# Altium schematic sheet FCC_MCU.SchDoc
size A4; SheetNumber: 5; SheetTotal: 8
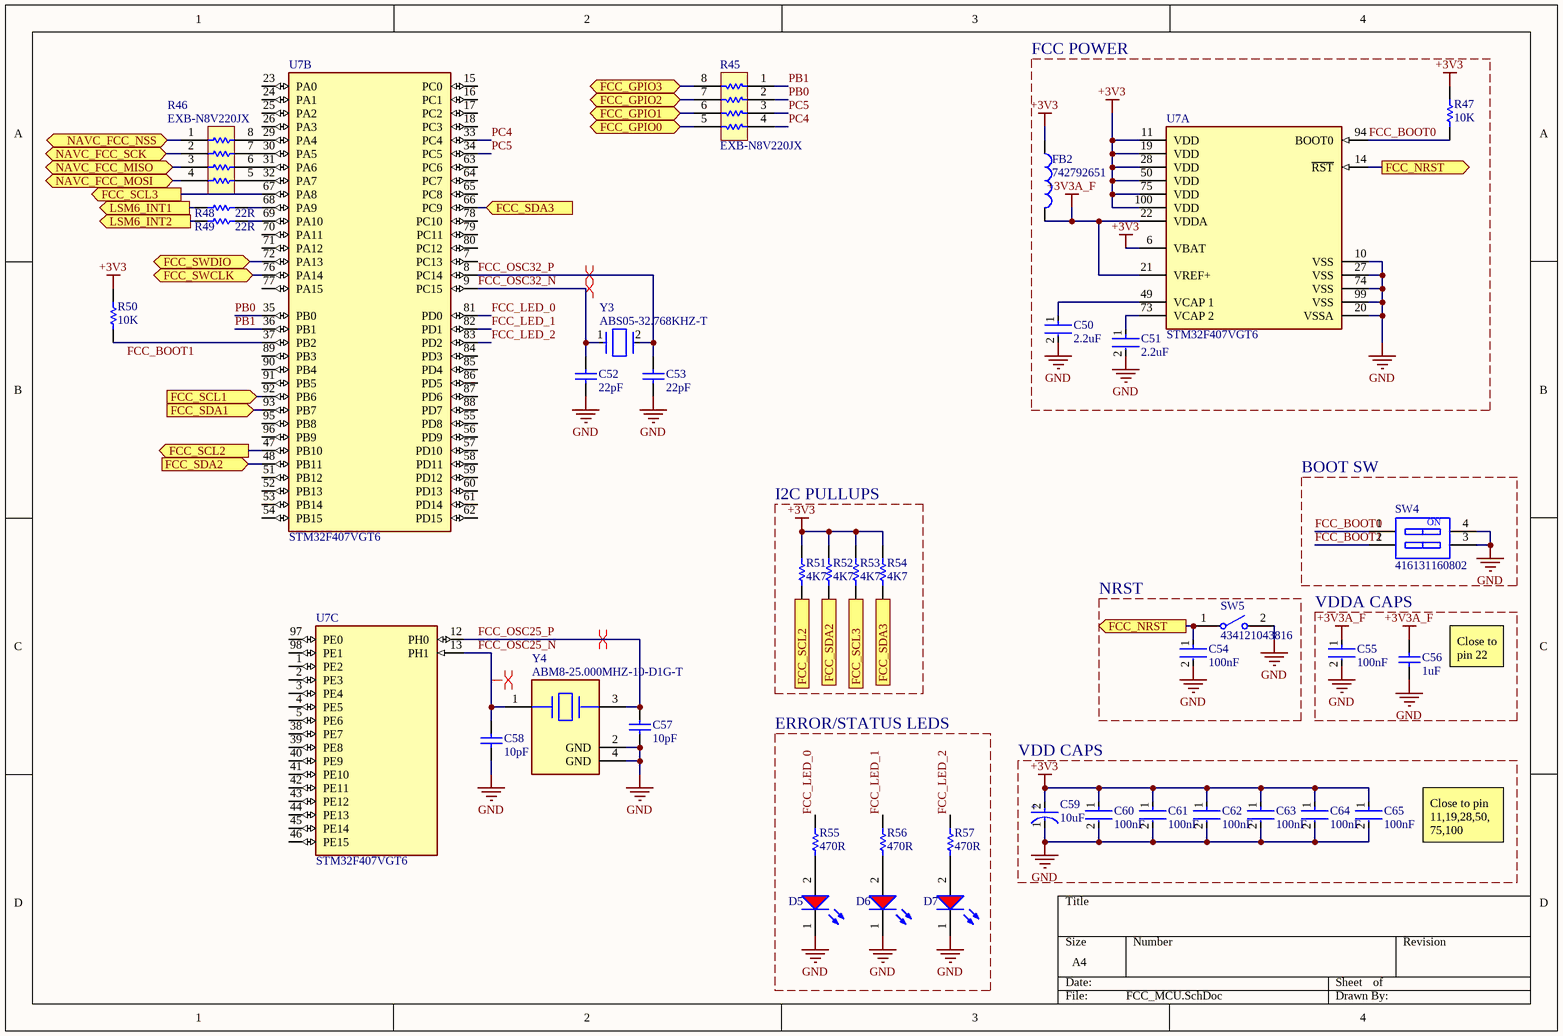
[diagram p0: FCC_MCU.SchDoc]

## Parts
C50  2.2uF  [FP-CGA3E-0_3-0_1-IPC_A]
C51  2.2uF  [FP-CGA3E-0_3-0_1-IPC_A]
C52  22pF  [CAPC1608X90X35ML10T15]
C53  22pF  [CAPC1608X90X35ML10T15]
C54  100nF  [FP-CGA3E-0_3-0_1-IPC_A]
C55  100nF  [FP-CGA3E-0_3-0_1-IPC_A]
C56  1uF  [CAPC1608X87X35LL15T15]
C57  10pF  [CAPC1608X90X35LL10T15]
C58  10pF  [CAPC1608X90X35LL10T15]
C59  10uF  [FP-T491A106K006AT-MFG]
C60  100nF  [FP-CGA3E-0_3-0_1-IPC_A]
C61  100nF  [FP-CGA3E-0_3-0_1-IPC_A]
C62  100nF  [FP-CGA3E-0_3-0_1-IPC_A]
C63  100nF  [FP-CGA3E-0_3-0_1-IPC_A]
C64  100nF  [FP-CGA3E-0_3-0_1-IPC_A]
C65  100nF  [FP-CGA3E-0_3-0_1-IPC_A]
D5  150120SS75000  [WL-SMCW_1206_150120xx75000]  (value not drawn)
D6  150120SS75000  [WL-SMCW_1206_150120xx75000]  (value not drawn)
D7  150120SS75000  [WL-SMCW_1206_150120xx75000]  (value not drawn)
FB2  742792651  [WE-CBF_0603_L1.6W0.8H0.8_HC]
R45  EXB-N8V220JX  [BOUR-CAT10_V]
R46  EXB-N8V220JX  [BOUR-CAT10_V]
R47  10K  [RESC1608X55X25ML10T15]
R48  22R  [RESC1608X55X25ML10T15]
R49  22R  [RESC1608X55X25ML10T15]
R50  10K  [RESC1608X55X25ML10T15]
R51  4K7  [RESC1608X55X25ML10T15]
R52  4K7  [RESC1608X55X25ML10T15]
R53  4K7  [RESC1608X55X25ML10T15]
R54  4K7  [RESC1608X55X25ML10T15]
R55  470R  [RESC1609X50X30NL8T20]
R56  470R  [RESC1609X50X30NL8T20]
R57  470R  [RESC1609X50X30NL8T20]
SW4  416131160802  [416131160802]
SW5  434121043816  [434121043816]
U7  STM32F407VGT6  [FP-LQFP100-1L-MFG]  (parts A,B,C of 3)
Y3  ABS05-32.768KHZ-T  [FP-ABS05-MFG]
Y4  ABM8-25.000MHZ-10-D1G-T  [FP-ABM8-MFG]

## Blocks framed on the sheet
FCC POWER: C50 C51 FB2 R47 U7
I2C PULLUPS: R51-R54
BOOT SW: SW4
NRST: C54 SW5
VDDA CAPS: C55 C56
ERROR/STATUS LEDS: D5-D7 R55-R57
VDD CAPS: C59-C65

## Ports
FCC_GPIO0 (bidir, see FCC_Connectors[1B]), FCC_GPIO1 (bidir, see FCC_Connectors[1B]), FCC_GPIO2 (bidir, see FCC_Connectors[1B]), FCC_GPIO3 (bidir, see FCC_Connectors[1B]), FCC_NRST (out, see FCC_Connectors[1A], FCC_MCU[3C]), FCC_NRST (out, see FCC_Connectors[1A], FCC_MCU[4A]), FCC_SCL1 (in, see FCC_Peripherals[1A]), FCC_SCL2 (out, see FCC_MCU[1B], FCC_Peripherals[2C]), FCC_SCL2 (out, see FCC_MCU[3C], FCC_Peripherals[2C]), FCC_SCL3 (out, see FCC_MCU[1A], FCC_Peripherals[2A]), FCC_SCL3 (out, see FCC_MCU[3C], FCC_Peripherals[2A]), FCC_SDA1 (in, see FCC_Peripherals[1B]), FCC_SDA2 (in, see FCC_MCU[3C], FCC_Peripherals[2C]), FCC_SDA2 (out, see FCC_MCU[1B], FCC_Peripherals[2C]), FCC_SDA3 (in, see FCC_MCU[3C], FCC_Peripherals[2A]), FCC_SDA3 (out, see FCC_MCU[2A], FCC_Peripherals[2A]), FCC_SWCLK (bidir, see FCC_Connectors[1A]), FCC_SWDIO (bidir, see FCC_Connectors[1A]), LSM6_INT1 (out, see FCC_Peripherals[2A]), LSM6_INT2 (out, see FCC_Peripherals[2A]), NAVC_FCC_MISO (bidir, see NAVC_MCU[1B]), NAVC_FCC_MOSI (bidir, see NAVC_MCU[1B]), NAVC_FCC_NSS (bidir, see NAVC_MCU[1B]), NAVC_FCC_SCK (bidir, see NAVC_MCU[1B])

## Nets
+3V3: C59.2(A) C60.1 C61.1 C62.1 C63.1 C64.1 C65.1 FB2.1 R47.1 R50.1 R51.2 R52.2 R53.2 R54.2 U7.6(VBAT) U7.11(VDD) U7.19(VDD) U7.28(VDD) U7.50(VDD) U7.75(VDD) U7.100(VDD)
+3V3A_F: C55.1 C56.2 FB2.2 U7.21(VREF+) U7.22(VDDA)
GND: C50.2 C51.2 C52.1 C53.1 C54.2 C55.2 C56.1 C57.1 C58.1 C59.1(C) C60.2 C61.2 C62.2 C63.2 C64.2 C65.2 D5.1(K) D6.1(K) D7.1(K) SW4.3 SW4.4 SW5.2 U7.10(VSS) U7.20(VSSA) U7.27(VSS) U7.74(VSS) U7.99(VSS) Y4.2(GND) Y4.4(GND)
FCC_BOOT0: R47.2 SW4.1 U7.94(BOOT0)
FCC_BOOT1: R50.2 SW4.2 U7.37(PB2)
FCC_GPIO0: R45.5 ; port FCC_GPIO0
FCC_GPIO1: R45.6 ; port FCC_GPIO1
FCC_GPIO2: R45.7 ; port FCC_GPIO2
FCC_GPIO3: R45.8 ; port FCC_GPIO3
FCC_LED_0: R55.1 U7.81(PD0)
FCC_LED_1: R56.1 U7.82(PD1)
FCC_LED_2: R57.1 U7.83(PD2)
FCC_NRST: C54.1 SW5.1 U7.14(~{RST}) ; port FCC_NRST
FCC_OSC25_N: C58.2 U7.13(PH1) Y4.1
FCC_OSC25_P: C57.2 U7.12(PH0) Y4.3
FCC_OSC32_N: C52.2 U7.9(PC15) Y3.1
FCC_OSC32_P: C53.2 U7.8(PC14) Y3.2
FCC_SCL1: U7.92(PB6) ; port FCC_SCL1
FCC_SCL2: R51.1 U7.47(PB10) ; port FCC_SCL2
FCC_SCL3: R53.1 U7.67(PA8) ; port FCC_SCL3
FCC_SDA1: U7.93(PB7) ; port FCC_SDA1
FCC_SDA2: R52.1 U7.48(PB11) ; port FCC_SDA2
FCC_SDA3: R54.1 U7.66(PC9) ; port FCC_SDA3
FCC_SWCLK: U7.76(PA14) ; port FCC_SWCLK
FCC_SWDIO: U7.72(PA13) ; port FCC_SWDIO
LSM6_INT1: R48.1 ; port LSM6_INT1
LSM6_INT2: R49.1 ; port LSM6_INT2
NAVC_FCC_MISO: R46.3 ; port NAVC_FCC_MISO
NAVC_FCC_MOSI: R46.4 ; port NAVC_FCC_MOSI
NAVC_FCC_NSS: R46.1 ; port NAVC_FCC_NSS
NAVC_FCC_SCK: R46.2 ; port NAVC_FCC_SCK
PB0: R45.2 U7.35(PB0)
PB1: R45.1 U7.36(PB1)
PC4: R45.4 U7.33(PC4)
PC5: R45.3 U7.34(PC5)
NetC50_1: C50.1 U7.49(VCAP_1)
NetC51_1: C51.1 U7.73(VCAP_2)
NetD5_2: D5.2(A) R55.2
NetD6_2: D6.2(A) R56.2
NetD7_2: D7.2(A) R57.2
NetR46_5: R46.5 U7.32(PA7)
NetR46_6: R46.6 U7.31(PA6)
NetR46_7: R46.7 U7.30(PA5)
NetR46_8: R46.8 U7.29(PA4)
NetR48_2: R48.2 U7.68(PA9)
NetR49_2: R49.2 U7.69(PA10)

Not connected (* = marked no-connect by the designer): U7 1(PE2) 2(PE3) 3(PE4) 4(PE5) 5(PE6) 7(PC13) 15(PC0) 16(PC1) 17(PC2) 18(PC3) 23(PA0) 24(PA1) 25(PA2) 26(PA3) 38(PE7) 39(PE8) 40(PE9) 41(PE10) 42(PE11) 43(PE12) 44(PE13) 45(PE14) 46(PE15) 51(PB12) 52(PB13) 53(PB14) 54(PB15) 55(PD8) 56(PD9) 57(PD10) 58(PD11) 59(PD12) 60(PD13) 61(PD14) 62(PD15) 63(PC6) 64(PC7) 65(PC8) 70(PA11) 71(PA12) 77(PA15) 78(PC10) 79(PC11) 80(PC12) 84(PD3) 85(PD4) 86(PD5) 87(PD6) 88(PD7) 89(PB3) 90(PB4) 91(PB5) 95(PB8) 96(PB9) 97(PE0) 98(PE1)

## Layout directives
differential pair: FCC_OSC25_N, FCC_OSC25_P, FCC_OSC32_N, FCC_OSC32_P

## Notes on the sheet
- (near C56) Close to pin 22
- Close to pin 11,19,28,50,
  75,100
- (in symbol CMP-1433-00002-2) ON
- (in symbol CMP-03017-000032-1) +

## Library data of the parts
C50 C51 C54 C55 C60-C65 = CMP-2000-07546-2: Cap Ceramic 100nF 50V X7R 10% Pad SMD 0603 +125°C Automotive T/R; Weight: 7.1E-05oz; Composition: Ceramic; Max Operating Temperature: 125°C; Termination: SMD/SMT; Dielectric: X7R; Length: 1.6mm; Package Quantity: 1; REACH SVHC: No SVHC; Lead Free: Lead Free; Case Code (Metric): 1608; Min Operating Temperature: -55°C; Packaging: Tape and Reel; Tolerance: 10%; Voltage Rating: 50V; Case Code (Imperial): 0603; Capacitance: 100nF; Case/Package: 0603; Voltage Rating (DC): 50V; Depth: 0.8mm; Radiation Hardening: No; Ratings: AEC-Q200; Mount: Surface Mount; Voltage: 50V; Thickness: 0.035inch; Width: 0.8mm; Height: 0.8mm
C52 C53 = CMP-2000-04945-1: Chip Capacitor, 22 pF, +/- 5%, 50 V, -55 to 125 degC, 0603 (1608 Metric), RoHS, Tape and Reel; Manufacturer: Murata; Rated Voltage: 50V; Dielectric: C0G; Capacitance: 22pF; Manufacturer URL: http://www.murata.com/; Datasheet Version: Jul-06; Package Reference: 603; Tolerance (%): ±5%; Case Size/Dimension: 0603; Package Description: 2-Pin Surface Mount Device, Body 1.6 x 0.8 mm; Datasheet URL: https://datasheet.ciiva.com/11786/0900766b807a1cab-11786398.pdf
C56 = CMP-2006-03713-1: Part Number: C0603C105K3RACTU; Manufacturer: Kemet
C57 C58 = CMP-2006-02592-1: Part Number: GRM1885C1H100JA01D; Manufacturer: Murata
C59 = CMP-03017-000032-1: CAP TANT 10UF 10% 6.3V 1206; Life (Hours): 2000Hour; Polarity: Polar; Dielectric Material: Tantalum; Leakage Current: 600nA; Dissipation Factor: 6%; ESR (Equivalent Series Resistance): 4R; Lead Free: Lead Free; Features: General Purpose; Length: 3.2mm; Mount: Surface Mount; Number of Pins: 2; RoHS Compliant: Yes; Case/Package: 1206; Width: 1.6mm; Capacitance: 10uF; REACH SVHC: No SVHC; Voltage Rating (DC): 6.3V; Max Operating Temperature: 125°C; Height - Seated (Max): 0.071inch; Termination: SMD/SMT; Radiation Hardening: No; Tolerance: 10%; Min Operating Temperature: -55°C; Lead Pitch: 1.2mm; Voltage: 6.3V; Depth: 1.6mm; Case Code (Imperial): 1206; Case Code (Metric): 3216; Packaging: Tape and Reel; Height: 1.6mm; Voltage Rating: 6.3V; Package Quantity: 1
D5-D7 = CMP-1426-00017-3: Led, Red, 630 Nm, 1.9 V, 30 Ma, 60 Mcd Rohs Compliant: Yes; Forward Current: 100mA; Max Reverse Voltage (DC): 5V; Lens Style: Clear, Rectangular; Viewing Angle: 140°; Luminous Intensity: 60mcd; Peak Wavelength: 645nm; Forward Voltage: 1.9V; Test Current: 20mA; Dominant Wavelength: 630nm; Case Code (Imperial): 1206; Length: 3.2mm; Mount: Surface Mount; Case Code (Metric): 3216; Case/Package: 1206; Min Operating Temperature: -40°C; Width: 1.6mm; Color: Red; Height: 680µm; REACH SVHC: Unknown; Max Operating Temperature: 85°C; Wavelength: 630nm; RoHS: Compliant; Packaging: Tape and Reel
FB2 = CMP-0220-00181-3: NexarPartId: 7864500; RMS Current (Irms): 1A; Number of Lines: 1; Test Frequency: 100MHz; Impedance: 600Ω; Inductance: 360mH; Resistance: 200mΩ; Tolerance: 25%; Case Code (Imperial): 0603; Lead Free: Lead Free; Current Rating: 1A; Height: 800µm; Min Operating Temperature: -55°C; Core Material: Ferrite; REACH SVHC: Unknown; Case/Package: 0603; Weight: 3.997283mg; Mount: Surface Mount; Termination: SMD/SMT; Case Code (Metric): 1608; DC Resistance (DCR): 200mΩ; Series Resistance: 200mΩ; Max Operating Temperature: 125°C; Width: 800µm; Length: 1.6mm; Max DC Current: 1A; RoHS: Compliant; Material: Ferrite; Max Current Rating: 1A; Depth: 800µm; Packaging: Cut Tape (CT)
R45 R46 = CMP-2000-06066-1: Chip Resistor Array, 22 Ohm, +/- 5%, -55 to 125 degC, 8-Pin SMD, RoHS, Tape and Reel; Manufacturer: Bourns; Resistance: 22Ohms; Temperature, Operating: -55to+125°C; Power, Rating: 0.125W; Number of Resistors: 4; Temperature, Coefficent: ±250; Brand/Series: CAT10Series; Circuit: IsolatedArray; Mounting Type: SurfaceMount; Tolerance: ±5%; Datasheet Version: 01/2015; Package Description: 8-Pin Surface Mount Device, Body 2 x 1 mm, Pitch 0.5 mm; Number of Terminals: 8; Dimensions: 0.44x0.039x0.022(2x1x0.55)LxWxHin.(mm); Package Reference: CAT10; Mounting Technology: SurfaceMount; Manufacturer URL: http://www.bourns.com/; Package Type: SMT; Datasheet URL: http://www.bourns.com/docs/Product-Datasheets/CAT10.pdf
R47-R54 = CMP-2100-03667-1: Chip Resistor, 0 Ohm, +/- 5%, 0.1 W, -55 to 155 degC, 0603 (1608 Metric), RoHS, Tape and Reel; Manufacturer: Yageo; Temperature Coefficient: 200ppm/degreesC; Voltage Rating: 50V; Power Rating: 100mW; Resistance: 0mOhm; Width: 0.8mm; Max Operating Temperature: 155degC; Tolerance: 5%; Package Reference: 0603; Height: 0.45mm; Depth: 0.8mm; Package Description: 2-Pin Surface Mount Device, Body 1.6 x 0.8 mm; Termination: SMD/SMT; Package Quantity: 5000; Case/Package: 0603; Case Code (Imperial): 0603; Radiation Hardening: No; Number of Pins: 2; Length: 1.6mm; Lead Free: LeadFree; Voltage Rating (DC): 50V; Military Standard: Not; Datasheet URL: http://www.yageo.com/NewPortal/yageodocoutput?fileName=/pdf/R-Chip/PYu-RC_Group_51_RoHS_L_5.pdf; Manufacturer URL: http://www.yageo.com/; Packaging: TapeandReel; Case Code (Metric): 1608; Min Operating Temperature: -55degC; Composition: ThickFilm; RoHSCompliant: true; Contact Plating: Tin; Datasheet Version: Rev. 5, 10/2016; REACH SVHC: NoSVHC
R55-R57 = CMP-2000-03816-5: Chip Resistor, 0 Ohm, Jumper, 100 mW, -55 to 155 degC, 0603 (1608 Metric), RoHS, Tape and Reel; Manufacturer: Vishay Semiconductor; Voltage Rating: 75 V; Package Quantity: 5000; DatasheetVersion: 06/2012; Min Operating Temperature: -55 degC; ComponentLink1URL: http://www.vishay.com/; Mounting Technology: Surface Mount; Height: 0.45 mm; ComponentLink1Description: Manufacturer URL; REACH SVHC: Unknown; PackageReference: 0603; Packaging: Tape and Reel; Max Operating Temperature: 155 degC; Mount: Surface Mount; ComponentLink2Description: Datasheet; PackageDescription: 2-Pin Surface Mount Device, Body 1.575 x 0.85 mm; Length: 1.55 mm; ComponentLink2URL: http://www.vishay.com/docs/20035/dcrcwe3.pdf; Pins: 2; RoHSCompliant: true
SW4 = CMP-1433-00002-2: NexarPartId: 19787098; Number of Circuits: 2; Throw Configuration: SPST; Voltage Rating (DC): 24V; Body Material: Polyphenylene; Mechanical Life: 2kcycles; Insulation Resistance: 100MΩ; Current Rating: 25mA; Electrical Life: 1kcycles; Washable: Yes; Contact Resistance: 50mΩ; Pitch: 1.27mm; Max Operating Temperature: 85°C; Number of Pins: 2; Contact Material: Gold; Width: 5.6mm; Color: Black; RoHS: Compliant; Min Operating Temperature: -40°C; Termination: Gull Wing; Packaging: Tape and Reel; Lead Free: Lead Free; Voltage Rating: 24V; Number of Positions: 2; REACH SVHC: No SVHC; Height: 2mm; Contact Current Rating: 25mA; Length: 3.71mm; Contact Plating: Gold; Max Voltage Rating (DC): 24V; Mount: Surface Mount
SW5 = CMP-1459-00005-3: Switch Tactile Spst-no 0.05A 12V; Contact Resistance: 100mΩ; Current Rating: 50mA; Operating Force: 160N; Packaging: Tape and Reel; Width: 6mm; Voltage Rating: 12V; Min Operating Temperature: -40°C; RoHS: Compliant; Height: 4.3mm; Insulation Resistance: 100MΩ; Contact Plating: Silver; Contact Current Rating: 50mA; Max Operating Temperature: 85°C
U7 = CMP-0243-00017-5: NexarPartId: 20570110; Manufacturer Package Identifier: 1L_ME_V5; Peripherals: Brown-out Detect/Reset, DMA, I2C, LCD, POR, PWM, WDT; Number of Programmable I/O: 82; Oscillator Type: Internal; Nominal Supply Current: 1.7µA; Number of Timers/Counters: 14; RAM Size: 192kB; Number of D/A Converters: 2; Number of Ethernet Channels: 1; Max Frequency: 168MHz; Number of SPI Channels: 3; Data Bus Width: 32b; Number of ADC Channels: 16; Max Supply Voltage: 3.6V; Number of USART Channels: 4; Interface: CAN, Ethernet, I2C, I2S, IrDA, LIN, SPI, UART, USART, USB; Max Junction Temperature (Tj): 125°C; Core Architecture: ARM Cortex-M4; Watchdog Timer: Yes; Memory Size: 1MB; Memory Type: FLASH; Min Supply Voltage: 1.8V; Number of I/Os: 82; Lead Free: Lead Free; Lifecycle Status: Production; Radiation Hardening: No; Frequency: 168MHz; Max Operating Temperature: 85°C; Height: 1.45mm; Number of Pins: 100; Number of I2C Channels: 3; Number of USB Channels: 1; REACH SVHC: No SVHC; Length: 14.2mm; Ambient Temperature Range High: 85°C; Schedule B: 8542310000, 8542310000; Number of Channels: 16; Number of A/D Converters: 3; Width: 14.2mm; Case/Package: LQFP; Flash Memory Size: 1MB; Min Operating Temperature: -40°C; Address Bus Width: 32b; Number of UART Channels: 2; RoHS: Compliant; Number of PWM Channels: 2
Y3 = CMP-27762-008890-2: Crystal 32.768kHz ±20ppm (Tol) 12.5pF FUND 90kΩ 2-Pin SMD T/R; Series Resistance: 90kR; Length: 1.6mm; Package Quantity: 3000; Packaging: Tape and Reel; Max Operating Temperature: 85°C; Lead Free: Lead Free; Tolerance: 20ppm; Frequency: 32.768kHz; Termination: SMD/SMT; REACH SVHC: No SVHC; Width: 1mm; Min Operating Temperature: -40°C; RoHS Compliant: Yes; Case/Package: CSMD; ESR (Equivalent Series Resistance): 90kR; Number of Pins: 2; Height: 0.5mm; Series: ABS05; Load Capacitance: 12.5pF; Frequency Tolerance: 20ppm; Depth: 1mm; Operating Frequency: 32.768 kHz; Mount: Surface Mount; Radiation Hardening: No
Y4 = CMP-27762-010178-1: Crystal 25MHz ±10ppm 10pF SMD-4 3.2mm x 2.5mm; Frequency Stability: 15ppm; ESR (Equivalent Series Resistance): 50R; Mount: Surface Mount; Load Capacitance: 10pF; Frequency Tolerance: 10ppm; Max Operating Temperature: 85°C; Frequency: 25MHz; Case/Package: SMD/SMT; Length: 0.126inch; RoHS Compliant: Yes; Min Operating Temperature: -40°C; Width: 0.098inch; Height: 0.031inch; Packaging: Tape and Reel